# Altium project ZZCBoard2.0.PrjPCB
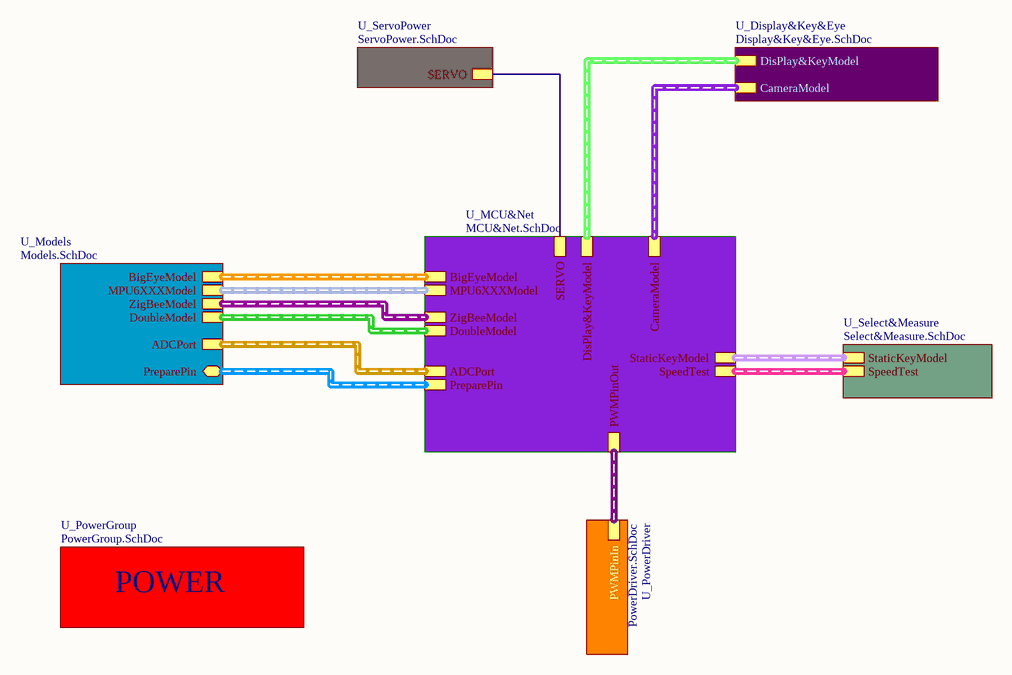
[diagram p0: BOSE.SchDoc]
8 sheets, 96 parts. Net scope: hierarchical (ports join the sheet entries above them; power ports are global).
Board file: BordPCB.PcbDoc
Sheets:
  BOSE.SchDoc
    U_MCU&Net = MCU&Net.SchDoc
    U_Display&Key&Eye = Display&Key&Eye.SchDoc
    U_PowerDriver = PowerDriver.SchDoc
    U_ServoPower = ServoPower.SchDoc
    U_Select&Measure = Select&Measure.SchDoc
    U_Models = Models.SchDoc
    U_PowerGroup = PowerGroup.SchDoc

## Sheet BOSE.SchDoc
size A4

### Sub-sheets
U_Display&Key&Eye = Display&Key&Eye.SchDoc: DisPlay&KeyModel (harness Display&Key), CameraModel (harness Camera)
U_MCU&Net = MCU&Net.SchDoc: ZigBeeModel (harness ZigBeeModel), CameraModel (harness Camera), BigEyeModel (harness BigEye), DisPlay&KeyModel (harness Display&Key), PWMPinOut (harness PWMPin), MPU6XXXModel (harness MPU6XXX), DoubleModel (harness Double), SpeedTest (harness Speed), SERVO, StaticKeyModel (harness StaticKey), PreparePin (harness Prepare), ADCPort (harness ADCPort)
U_Models = Models.SchDoc: MPU6XXXModel (harness MPU6XXX), ZigBeeModel (harness ZigBeeModel), BigEyeModel (harness BigEye), DoubleModel (harness Double), ADCPort (harness ADCPort), PreparePin (harness Prepare)
U_PowerDriver = PowerDriver.SchDoc: PWMPinIn (harness PWMPin)
U_PowerGroup = PowerGroup.SchDoc: no entries
U_Select&Measure = Select&Measure.SchDoc: SpeedTest (harness Speed), StaticKeyModel (harness StaticKey)
U_ServoPower = ServoPower.SchDoc: SERVO

### Nets
SERVO: sheet U_MCU&Net/SERVO, sheet U_ServoPower/SERVO

### Buses and harness runs
harness sheet U_Display&Key&Eye/CameraModel = sheet U_MCU&Net/CameraModel
harness sheet U_Display&Key&Eye/DisPlay&KeyModel = sheet U_MCU&Net/DisPlay&KeyModel
harness sheet U_MCU&Net/ADCPort = sheet U_Models/ADCPort
harness sheet U_MCU&Net/BigEyeModel = sheet U_Models/BigEyeModel
harness sheet U_MCU&Net/DoubleModel = sheet U_Models/DoubleModel
harness sheet U_MCU&Net/MPU6XXXModel = sheet U_Models/MPU6XXXModel
harness sheet U_MCU&Net/PreparePin = sheet U_Models/PreparePin
harness sheet U_MCU&Net/PWMPinOut = sheet U_PowerDriver/PWMPinIn
harness sheet U_MCU&Net/SpeedTest = sheet U_Select&Measure/SpeedTest
harness sheet U_MCU&Net/StaticKeyModel = sheet U_Select&Measure/StaticKeyModel
harness sheet U_MCU&Net/ZigBeeModel = sheet U_Models/ZigBeeModel

### Notes on the sheet
- POWER

## Sheet MCU&Net.SchDoc
size A4
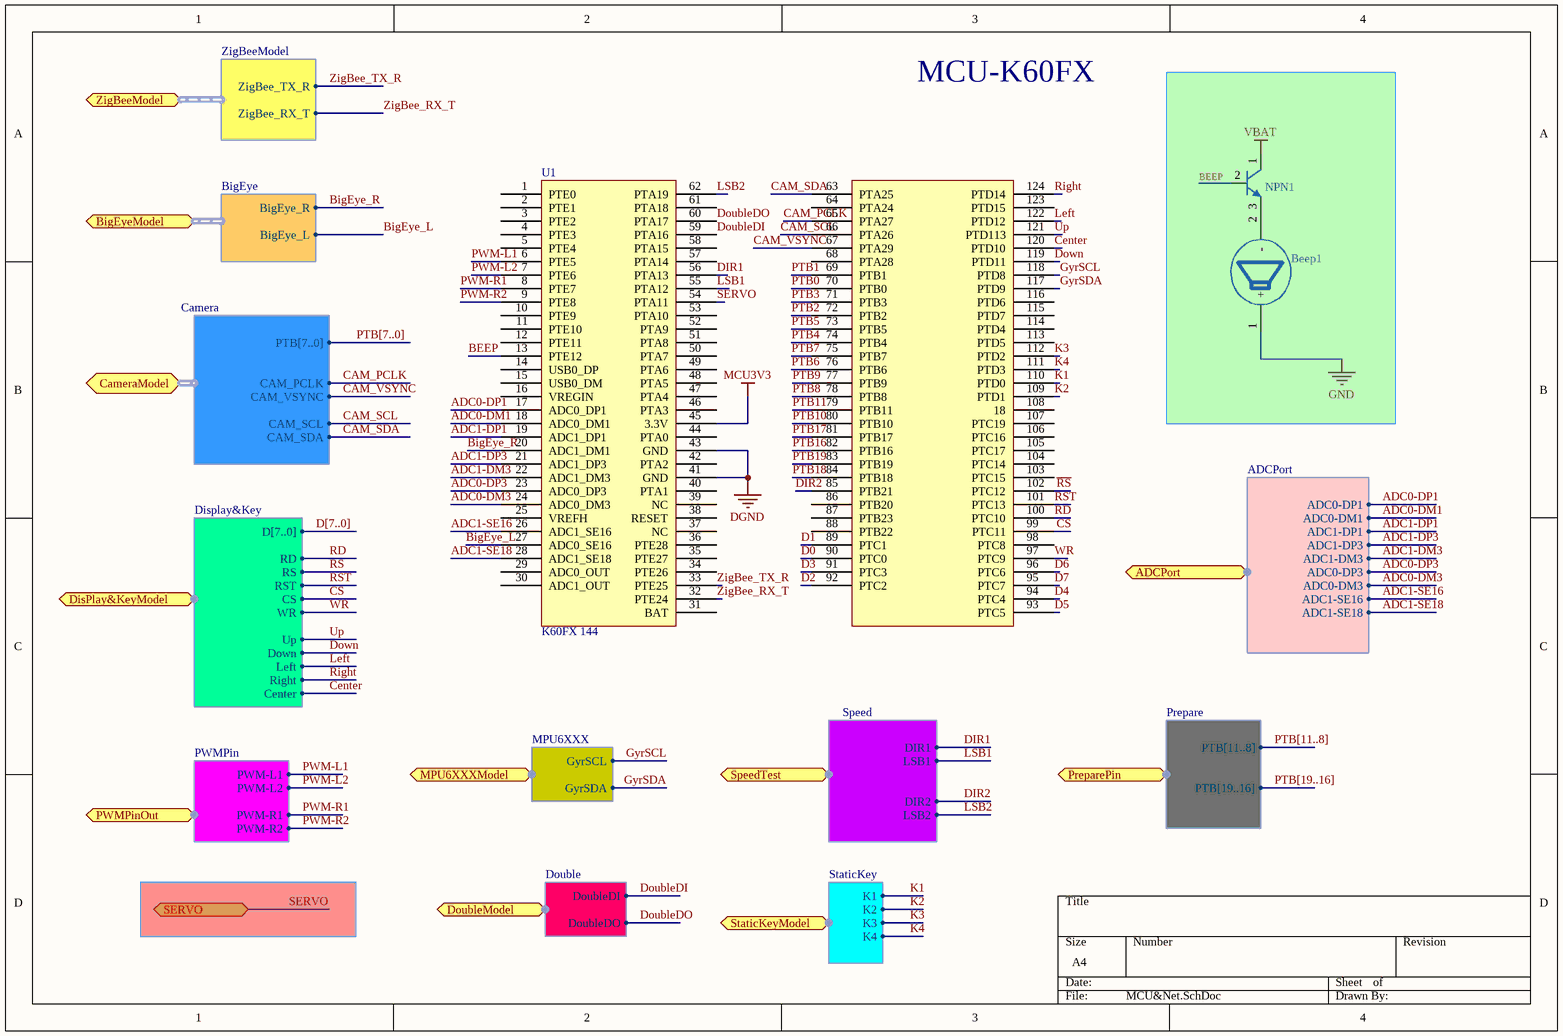
[diagram p1: MCU&Net.SchDoc]

### Parts
Beep1  BEEP  [BEEP]  (value not drawn)
NPN1  NPN  [三极管  NPN]  (value not drawn)
U1  K60FX 144  [K60FX 144]

### Ports
ADCPort (harness ADCPort), BigEyeModel (harness BigEye), CameraModel (harness Camera), DisPlay&KeyModel (harness Display&Key), DoubleModel (harness Double), MPU6XXXModel (harness MPU6XXX), PreparePin (harness Prepare), PWMPinOut (harness PWMPin), SERVO, SpeedTest (harness Speed), StaticKeyModel (harness StaticKey), ZigBeeModel (harness ZigBeeModel)

### Harnesses
Camera: PTB[7..0], CAM_PCLK, CAM_SCL, CAM_VSYNC, CAM_SDA
ZigBeeModel: ZigBee_TX_R, ZigBee_RX_T
BigEye: BigEye_R, BigEye_L
Display&Key: D[7..0], RD, RS, RST, CS, Up, Down, Left, Right, Center, WR
PWMPin: PWM-L1, PWM-L2, PWM-R1, PWM-R2
MPU6XXX: GyrSCL, GyrSDA
Double: DoubleDI, DoubleDO
Speed: DIR1, LSB1, LSB2, DIR2
StaticKey: K1, K2, K3, K4
Prepare: PTB[11..8], PTB[19..16]
ADCPort: ADC0-DP1, ADC0-DM1, ADC1-DP1, ADC1-DP3, ADC1-DM3, ADC0-DP3, ADC0-DM3, ADC1-SE16, ADC1-SE18

### Nets
DGND: U1.41(GND) U1.43(GND)
GND: Beep1.1(+)
MCU3V3: U1.45(3.3V)
VBAT: NPN1.1
ADC0-DM1: U1.18(ADC0_DM1) ; port ADCPort.ADC0-DM1
ADC0-DM3: U1.24(ADC0_DM3) ; port ADCPort.ADC0-DM3
ADC0-DP1: U1.17(ADC0_DP1) ; port ADCPort.ADC0-DP1
ADC0-DP3: U1.23(ADC0_DP3) ; port ADCPort.ADC0-DP3
ADC1-DM3: U1.22(ADC1_DM3) ; port ADCPort.ADC1-DM3
ADC1-DP1: U1.19(ADC1_DP1) ; port ADCPort.ADC1-DP1
ADC1-DP3: U1.21(ADC1_DP3) ; port ADCPort.ADC1-DP3
ADC1-SE16: U1.26(ADC1_SE16) ; port ADCPort.ADC1-SE16
ADC1-SE18: U1.28(ADC1_SE18) ; port ADCPort.ADC1-SE18
BEEP: NPN1.2 U1.13(PTE12)
BigEye_L: U1.27(ADC0_SE16) ; port BigEyeModel.BigEye_L
BigEye_R: U1.20(ADC1_DM1) ; port BigEyeModel.BigEye_R
CAM_PCLK: U1.65(PTA27) ; port CameraModel.CAM_PCLK
CAM_SCL: U1.66(PTA26) ; port CameraModel.CAM_SCL
CAM_SDA: U1.63(PTA25) ; port CameraModel.CAM_SDA
CAM_VSYNC: U1.67(PTA29) ; port CameraModel.CAM_VSYNC
Center: U1.120(PTD10) ; port DisPlay&KeyModel.Center
CS: U1.99(PTC11) ; port DisPlay&KeyModel.CS
D0: U1.90(PTC0)
D1: U1.89(PTC1)
D2: U1.92(PTC2)
D3: U1.91(PTC3)
D4: U1.94(PTC4)
D5: U1.93(PTC5)
D6: U1.96(PTC6)
D7: U1.95(PTC7)
DIR1: U1.56(PTA13) ; port SpeedTest.DIR1
DIR2: U1.85(PTB21) ; port SpeedTest.DIR2
DoubleDI: U1.59(PTA16) ; port DoubleModel.DoubleDI
DoubleDO: U1.60(PTA17) ; port DoubleModel.DoubleDO
Down: U1.119(PTD11) ; port DisPlay&KeyModel.Down
GyrSCL: U1.118(PTD8) ; port MPU6XXXModel.GyrSCL
GyrSDA: U1.117(PTD9) ; port MPU6XXXModel.GyrSDA
K1: U1.110(PTD0) ; port StaticKeyModel.K1
K2: U1.109(PTD1) ; port StaticKeyModel.K2
K3: U1.112(PTD2) ; port StaticKeyModel.K3
K4: U1.111(PTD3) ; port StaticKeyModel.K4
Left: U1.122(PTD12) ; port DisPlay&KeyModel.Left
LSB1: U1.55(PTA12) ; port SpeedTest.LSB1
LSB2: U1.62(PTA19) ; port SpeedTest.LSB2
PTB0: U1.70(PTB0)
PTB1: U1.69(PTB1)
PTB2: U1.72(PTB2)
PTB3: U1.71(PTB3)
PTB4: U1.74(PTB4)
PTB5: U1.73(PTB5)
PTB6: U1.76(PTB6)
PTB7: U1.75(PTB7)
PTB8: U1.78(PTB8)
PTB9: U1.77(PTB9)
PTB10: U1.80(PTB10)
PTB11: U1.79(PTB11)
PTB16: U1.82(PTB16)
PTB17: U1.81(PTB17)
PTB18: U1.84(PTB18)
PTB19: U1.83(PTB19)
PWM-L1: U1.6(PTE5) ; port PWMPinOut.PWM-L1
PWM-L2: U1.7(PTE6) ; port PWMPinOut.PWM-L2
PWM-R1: U1.8(PTE7) ; port PWMPinOut.PWM-R1
PWM-R2: U1.9(PTE8) ; port PWMPinOut.PWM-R2
~{RS}: U1.102(PTC12) ; port DisPlay&KeyModel.RS
RD: U1.100(PTC10) ; port DisPlay&KeyModel.RD
Right: U1.124(PTD14) ; port DisPlay&KeyModel.Right
RST: U1.101(PTC13) ; port DisPlay&KeyModel.RST
SERVO: U1.54(PTA11) ; port SERVO
Up: U1.121(PTD113) ; port DisPlay&KeyModel.Up
WR: U1.97(PTC9) ; port DisPlay&KeyModel.WR
ZigBee_RX_T: U1.32(PTE24) ; port ZigBeeModel.ZigBee_RX_T
ZigBee_TX_R: U1.33(PTE25) ; port ZigBeeModel.ZigBee_TX_R
NetBeep1_2: Beep1.2(-) NPN1.3

Not connected (* = marked no-connect by the designer): U1 1(PTE0) 2(PTE1) 3(PTE2) 4(PTE3) 5(PTE4) 10(PTE9) 11(PTE10) 12(PTE11) 14(USB0_DP) 15(USB0_DM) 16(VREGIN) 25(VREFH) 29(ADC0_OUT) 30(ADC1_OUT) 31(BAT) 34(PTE26) 35(PTE27) 36(PTE28) 37(NC) 38(RESET) 39(NC) 40(PTA1) 42(PTA2) 44(PTA0) 46(PTA3) 47(PTA4) 48(PTA5) 49(PTA6) 50(PTA7) 51(PTA8) 52(PTA9) 53(PTA10) 57(PTA14) 58(PTA15) 61(PTA18) 64(PTA24) 68(PTA28) 86(PTB20) 87(PTB23) 88(PTB22) 98(PTC8) 103(PTC15) 104(PTC14) 105(PTC17) 106(PTC16) 107(PTC19) 108(18) 113(PTD5) 114(PTD4) 115(PTD7) 116(PTD6) 123(PTD15)

### Buses and harness runs
bus D[7..0]
bus PTB[7..0]
bus PTB[11..8]
bus PTB[19..16]

### Notes on the sheet
- MCU-K60FX

### Library data of the parts
Beep1 = 蜂鸣器
U1 = K60FX   144

## Sheet Display&Key&Eye.SchDoc
size A4
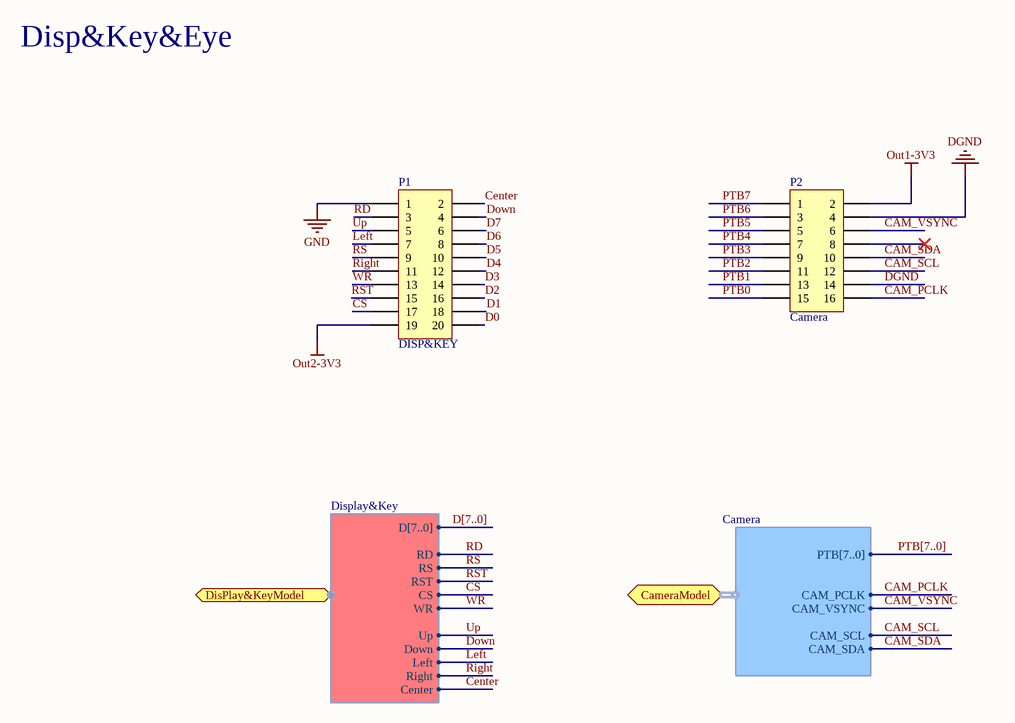
[diagram p2: Display&Key&Eye.SchDoc]

### Parts
P1  DISP&KEY  [HDR2X10]
P2  Camera  [HDR2X8]

### Ports
CameraModel (harness Camera), DisPlay&KeyModel (harness Display&Key)

### Harnesses
Display&Key: D[7..0], RD, RS, RST, CS, Up, Down, Left, Right, Center, WR
Camera: PTB[7..0], CAM_PCLK, CAM_SCL, CAM_VSYNC, CAM_SDA

### Nets
DGND: P2.4 P2.14
GND: P1.1
Out1-3V3: P2.2
Out2-3V3: P1.19
CAM_PCLK: P2.16 ; port CameraModel.CAM_PCLK
CAM_SCL: P2.12 ; port CameraModel.CAM_SCL
CAM_SDA: P2.10 ; port CameraModel.CAM_SDA
CAM_VSYNC: P2.6 ; port CameraModel.CAM_VSYNC
Center: P1.2 ; port DisPlay&KeyModel.Center
CS: P1.17 ; port DisPlay&KeyModel.CS
D0: P1.20
D1: P1.18
D2: P1.16
D3: P1.14
D4: P1.12
D5: P1.10
D6: P1.8
D7: P1.6
Down: P1.4 ; port DisPlay&KeyModel.Down
Left: P1.7 ; port DisPlay&KeyModel.Left
PTB0: P2.15
PTB1: P2.13
PTB2: P2.11
PTB3: P2.9
PTB4: P2.7
PTB5: P2.5
PTB6: P2.3
PTB7: P2.1
~{RS}: P1.9 ; port DisPlay&KeyModel.RS
RD: P1.3 ; port DisPlay&KeyModel.RD
Right: P1.11 ; port DisPlay&KeyModel.Right
RST: P1.15 ; port DisPlay&KeyModel.RST
Up: P1.5 ; port DisPlay&KeyModel.Up
WR: P1.13 ; port DisPlay&KeyModel.WR

Not connected (* = marked no-connect by the designer): P2 8*

### Buses and harness runs
bus D[7..0]
bus PTB[7..0]

### Notes on the sheet
- Disp&Key&Eye

### Library data of the parts
P1 = Header 10X2: Header, 10-Pin, Dual row; LatestRevisionDate: 17-Jul-2002; LatestRevisionNote: Re-released for DXP Platform.; Publisher: Altium Limited
P2 = Header 8X2: Header, 8-Pin, Dual row; LatestRevisionDate: 17-Jul-2002; LatestRevisionNote: Re-released for DXP Platform.; Publisher: Altium Limited

## Sheet PowerDriver.SchDoc
size A4
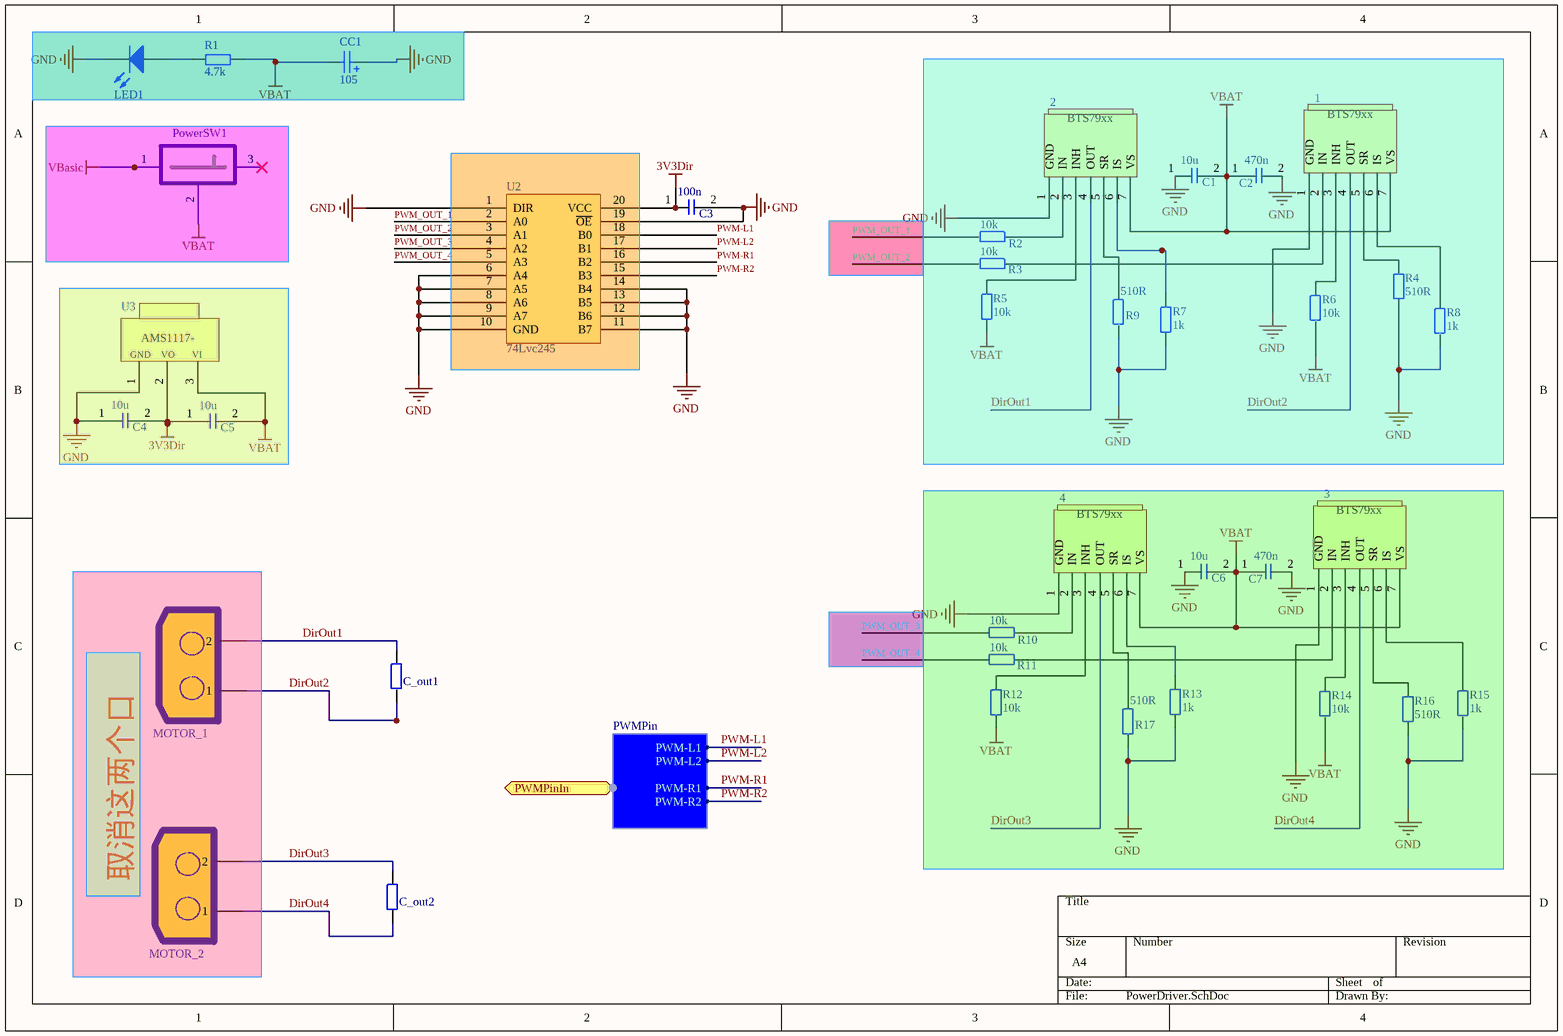
[diagram p3: PowerDriver.SchDoc]

### Parts
1  BTS79xx  [BTS79xx]  (value not drawn)
2  BTS79xx  [BTS79xx]  (value not drawn)
3  BTS79xx  [BTS79xx]  (value not drawn)
4  BTS79xx  [BTS79xx]  (value not drawn)
C1  10u  [0805电容]
C2  470n  [0805电容]
C3  100n  [0805电容]
C4  10u  [0805电容]
C5  10u  [0805电容]
C6  10u  [0805电容]
C7  470n  [0805电容]
C_out1  0  [0805电阻]  (value not drawn)
C_out2  0  [0805电阻]  (value not drawn)
CC1  Capacitance: 105  [CAPMP6032X26N]  (hidden comment: Cap Tan C)
LED1  0805LED  [0805LED]  (value not drawn)
MOTOR_1  P  [2脚接头]  (value not drawn)
MOTOR_2  P  [2脚接头]  (value not drawn)
PowerSW1  Power  [PowerSW]  (value not drawn)
R1  4.7k  [0805电阻]
R2  10k  [0805电阻]
R3  10k  [0805电阻]
R4  510R  [0805电阻]
R5  10k  [0805电阻]
R6  10k  [0805电阻]
R7  1k  [0805电阻]
R8  1k  [0805电阻]
R9  510R  [0805电阻]
R10  10k  [0805电阻]
R11  10k  [0805电阻]
R12  10k  [0805电阻]
R13  1k  [0805电阻]
R14  10k  [0805电阻]
R15  1k  [0805电阻]
R16  510R  [0805电阻]
R17  510R  [0805电阻]
U2  74Lvc245  [TSOP65P650X110-20N]
U3  AMS1117-  [AMS1117-]  (value not drawn)

### Blocks framed on the sheet
取消这两个口: MOTOR_1 MOTOR_2

### Ports
PWMPinIn (harness PWMPin)

### Harnesses
PWMPin: PWM-L1, PWM-L2, PWM-R1, PWM-R2

### Nets
3V3Dir: C3.1 C4.2 C5.1 U2.20(VCC) U3.2(Vout)
GND: 1.1(GND) 2.1(GND) 3.1(GND) 4.1(GND) C1.1 C2.2 C3.2 C4.1 C6.1 C7.2 CC1.2 LED1.2(K) R4.1 R7.1 R8.1 R9.1 R13.1 R15.1 R16.1 R17.1 U2.1(DIR) U2.6(A4) U2.7(A5) U2.8(A6) U2.9(A7) U2.10(GND) U2.11(B7) U2.12(B6) U2.13(B5) U2.14(B4) U2.19(~{OE}) U3.1(GND)
VBasic: PowerSW1.1
VBAT: 1.7(VS) 2.7(VS) 3.7(VS) 4.7(VS) C1.2 C2.1 C5.2 C6.2 C7.1 CC1.1 PowerSW1.2 R1.1 R5.1 R6.1 R12.1 R14.1 U3.3(Vin)
DirOut1: 2.4(OUT) C_out1.2 MOTOR_1.2
DirOut2: 1.4(OUT) C_out1.1 MOTOR_1.1
DirOut3: 4.4(OUT) C_out2.2 MOTOR_2.2
DirOut4: 3.4(OUT) C_out2.1 MOTOR_2.1
PWM-L1: U2.18(B0) ; port PWMPinIn.PWM-L1
PWM-L2: U2.17(B1) ; port PWMPinIn.PWM-L2
PWM-R1: U2.16(B2) ; port PWMPinIn.PWM-R1
PWM-R2: U2.15(B3) ; port PWMPinIn.PWM-R2
PWM_OUT_1: R2.1 U2.2(A0)
PWM_OUT_2: R3.1 U2.3(A1)
PWM_OUT_3: R10.1 U2.4(A2)
PWM_OUT_4: R11.1 U2.5(A3)
Net1_2: 1.2(IN) R3.2
Net1_3: 1.3(INH) R6.2
Net1_5: 1.5(SR) R4.2
Net1_6: 1.6(IS) R8.2
Net2_2: 2.2(IN) R2.2
Net2_3: 2.3(INH) R5.2
Net2_5: 2.5(SR) R9.2
Net2_6: 2.6(IS) R7.2
Net3_2: 3.2(IN) R11.2
Net3_3: 3.3(INH) R14.2
Net3_5: 3.5(SR) R16.2
Net3_6: 3.6(IS) R15.2
Net4_2: 4.2(IN) R10.2
Net4_3: 4.3(INH) R12.2
Net4_5: 4.5(SR) R17.2
Net4_6: 4.6(IS) R13.2
NetLED1_1: LED1.1(A) R1.2

Not connected (* = marked no-connect by the designer): PowerSW1 3*

### Notes on the sheet
- (in symbol AMS1117-) VO; VI

### Library data of the parts
C1-C7 = 0805电容
C_out1 C_out2 R1-R17 = 0805电阻
CC1 = Cap Tan C: Polarized Capacitor (Radial); Voltage: 16V; Published: 8-Jun-2000; Revision: July-2002: Re-released for DXP Platform.; Publisher: Altium Limited
MOTOR_1 MOTOR_2 = 2脚接头
PowerSW1 = PowerSW

## Sheet ServoPower.SchDoc
size A4
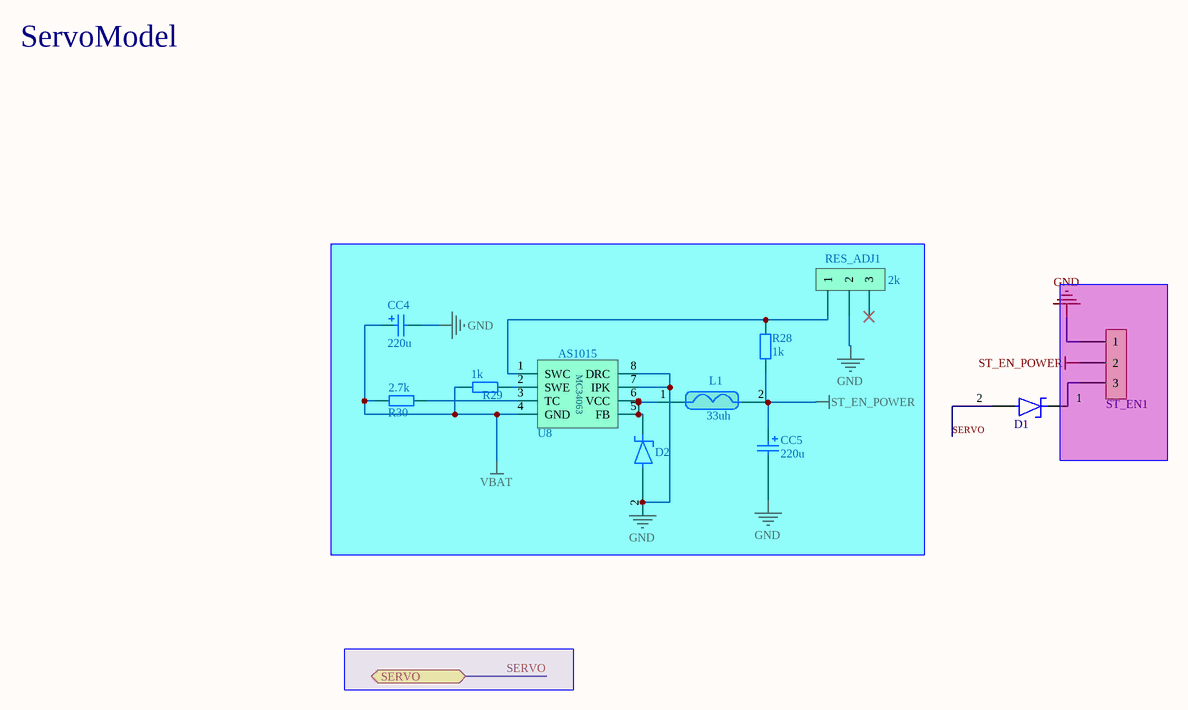
[diagram p4: ServoPower.SchDoc]

### Parts
CC4  Capacitance: 220u  [CAPMP6032X26N]  (hidden comment: Cap Tan C)
CC5  Capacitance: 220u  [CAPMP6032X26N]  (hidden comment: Cap Tan C)
D1  贴片二极管  [二极管SMA]  (value not drawn)
D2  贴片二极管  [二极管SMA]  (value not drawn)
L1  33uh  [电感7.3X7.3]
R28  1k  [0805电阻]
R29  1k  [0805电阻]
R30  2.7k  [0805电阻]
RES_ADJ1  2k  [Header3]
ST_EN1  Header3  [Header3]  (value not drawn)
U8  AS1015  [MC34063]

### Ports
SERVO

### Nets
GND: CC4.1 CC5.1 D2.2 RES_ADJ1.2 ST_EN1.1 U8.7(IPK) U8.8(DRC)
ST_EN_POWER: CC5.2 L1.2 R28.1 ST_EN1.2
VBAT: CC4.2 R29.1 R30.1 U8.4(GND)
SERVO: D1.2 ; port SERVO
NetD1_1: D1.1 ST_EN1.3
NetD2_1: D2.1 L1.1 U8.5(FB) U8.6(VCC)
NetR28_2: R28.2 RES_ADJ1.1 U8.1(SWC)
NetR29_2: R29.2 U8.2(SWE)
NetR30_2: R30.2 U8.3(TC)

Not connected (* = marked no-connect by the designer): RES_ADJ1 3*

### Notes on the sheet
- ServoModel

### Library data of the parts
CC4 CC5 = Cap Tan C: as CC1 on sheet PowerDriver; Published: 8-Jun-2000; Revision: July-2002: Re-released for DXP Platform.; Publisher: Altium Limited
L1 = 电感
R28-R30 = 0805电阻
RES_ADJ1 = Header3
U8 = MC34063

## Sheet Select&Measure.SchDoc
size A4
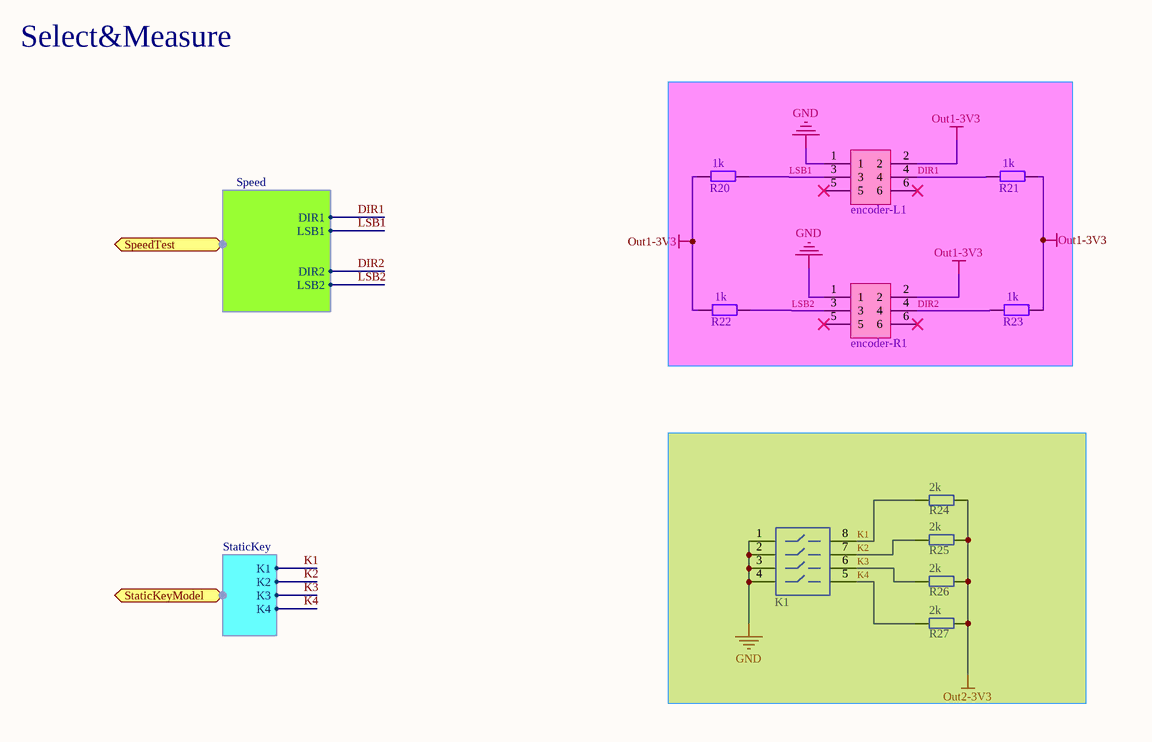
[diagram p5: Select&Measure.SchDoc]

### Parts
encoder-L1  编码器  [编码器]  (value not drawn)
encoder-R1  编码器  [编码器]  (value not drawn)
K1  拨码开关  [拨码开关]  (value not drawn)
R20  1k  [0805电阻]
R21  1k  [0805电阻]
R22  1k  [0805电阻]
R23  1k  [0805电阻]
R24  2k  [0805电阻]
R25  2k  [0805电阻]
R26  2k  [0805电阻]
R27  2k  [0805电阻]

### Ports
SpeedTest (harness Speed), StaticKeyModel (harness StaticKey)

### Harnesses
Speed: DIR1, LSB1, LSB2, DIR2
StaticKey: K1, K2, K3, K4

### Nets
GND: encoder-L1.1 encoder-R1.1 K1.1 K1.2 K1.3 K1.4
Out1-3V3: encoder-L1.2 encoder-R1.2 R20.1 R21.2 R22.1 R23.2
Out2-3V3: R24.2 R25.2 R26.2 R27.2
DIR1: encoder-L1.4 R21.1 ; port SpeedTest.DIR1
DIR2: encoder-R1.4 R23.1 ; port SpeedTest.DIR2
K1: K1.8 R24.1 ; port StaticKeyModel.K1
K2: K1.7 R25.1 ; port StaticKeyModel.K2
K3: K1.6 R26.1 ; port StaticKeyModel.K3
K4: K1.5 R27.1 ; port StaticKeyModel.K4
LSB1: encoder-L1.3 R20.2 ; port SpeedTest.LSB1
LSB2: encoder-R1.3 R22.2 ; port SpeedTest.LSB2

Not connected (* = marked no-connect by the designer): encoder-L1 5* 6*; encoder-R1 5* 6*

### Notes on the sheet
- Select&Measure

### Library data of the parts
R20-R27 = 0805电阻

## Sheet Models.SchDoc
size A4
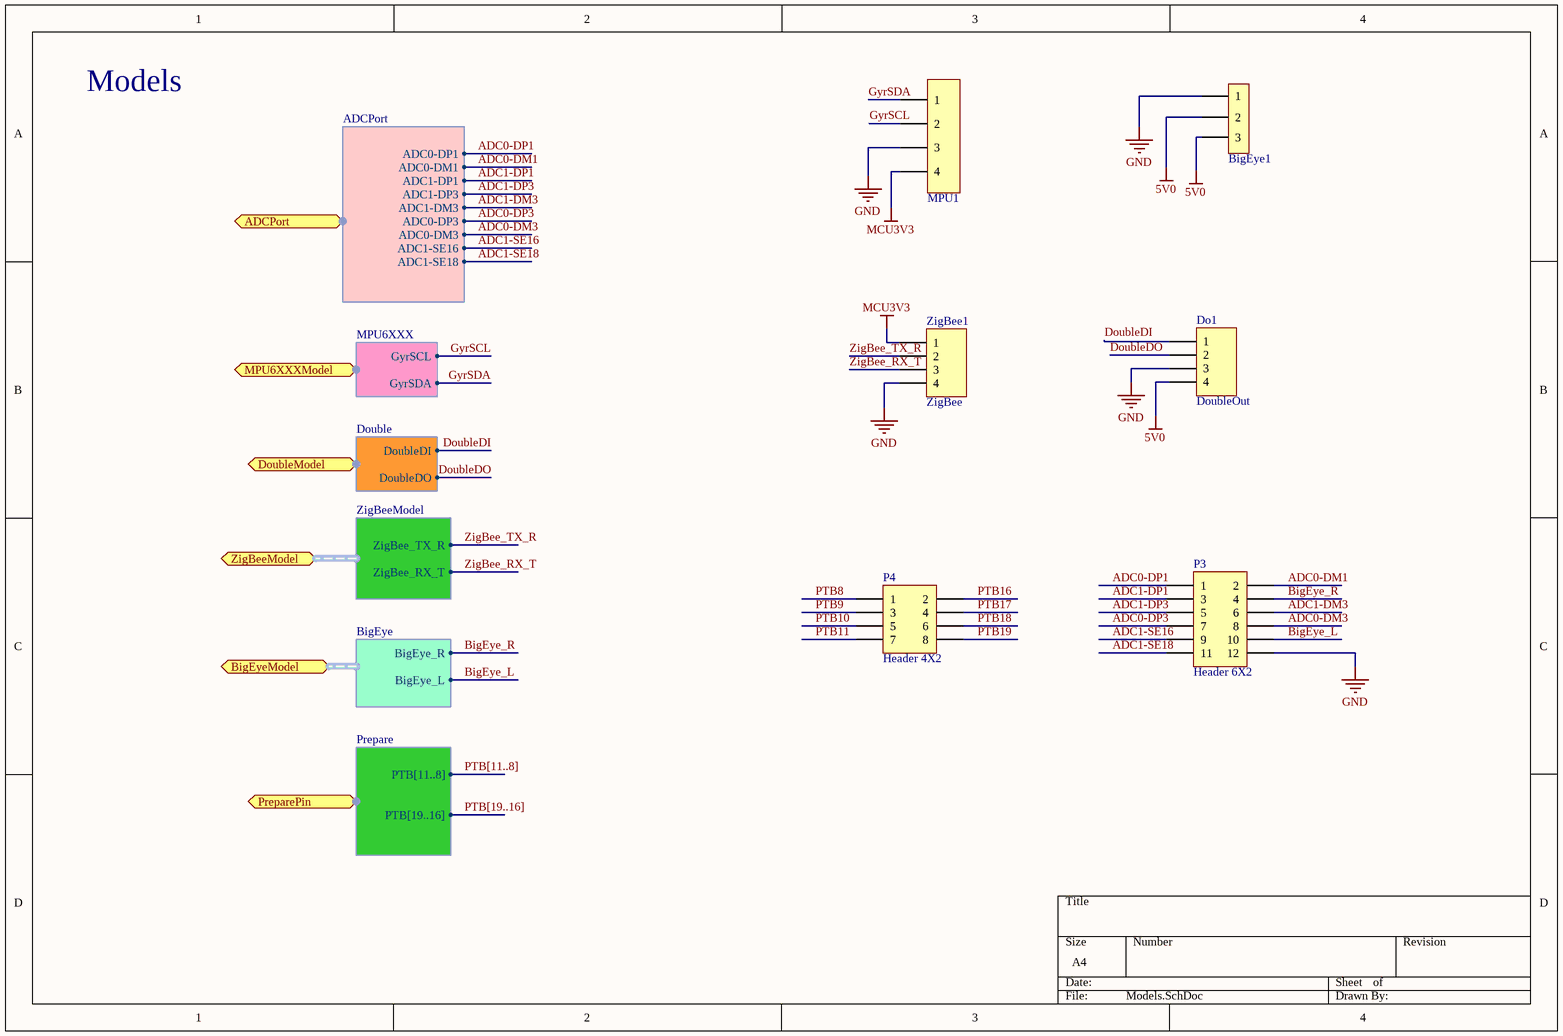
[diagram p6: Models.SchDoc]

### Parts
BigEye1  Header3  [Header3]  (value not drawn)
Do1  DoubleOut  [HDR1X4]
MPU1  Header4  [Header4]  (value not drawn)
P3  Header 6X2  [HDR2X6]
P4  Header 4X2  [HDR2X4]
ZigBee1  ZigBee  [HDR1X4]

### Ports
ADCPort (harness ADCPort), BigEyeModel (harness BigEye), DoubleModel (harness Double), MPU6XXXModel (harness MPU6XXX), PreparePin (harness Prepare), ZigBeeModel (harness ZigBeeModel)

### Harnesses
MPU6XXX: GyrSCL, GyrSDA
ZigBeeModel: ZigBee_TX_R, ZigBee_RX_T
BigEye: BigEye_R, BigEye_L
Double: DoubleDI, DoubleDO
ADCPort: ADC0-DP1, ADC0-DM1, ADC1-DP1, ADC1-DP3, ADC1-DM3, ADC0-DP3, ADC0-DM3, ADC1-SE16, ADC1-SE18
Prepare: PTB[11..8], PTB[19..16]

### Nets
5V0: BigEye1.2 BigEye1.3 Do1.4
GND: BigEye1.1 Do1.3 MPU1.3 P3.12 ZigBee1.4
MCU3V3: MPU1.4 ZigBee1.1
ADC0-DM1: P3.2 ; port ADCPort.ADC0-DM1
ADC0-DM3: P3.8 ; port ADCPort.ADC0-DM3
ADC0-DP1: P3.1 ; port ADCPort.ADC0-DP1
ADC0-DP3: P3.7 ; port ADCPort.ADC0-DP3
ADC1-DM3: P3.6 ; port ADCPort.ADC1-DM3
ADC1-DP1: P3.3 ; port ADCPort.ADC1-DP1
ADC1-DP3: P3.5 ; port ADCPort.ADC1-DP3
ADC1-SE16: P3.9 ; port ADCPort.ADC1-SE16
ADC1-SE18: P3.11 ; port ADCPort.ADC1-SE18
BigEye_L: P3.10 ; port BigEyeModel.BigEye_L
BigEye_R: P3.4 ; port BigEyeModel.BigEye_R
DoubleDI: Do1.1 ; port DoubleModel.DoubleDI
DoubleDO: Do1.2 ; port DoubleModel.DoubleDO
GyrSCL: MPU1.2 ; port MPU6XXXModel.GyrSCL
GyrSDA: MPU1.1 ; port MPU6XXXModel.GyrSDA
PTB8: P4.1
PTB9: P4.3
PTB10: P4.5
PTB11: P4.7
PTB16: P4.2
PTB17: P4.4
PTB18: P4.6
PTB19: P4.8
ZigBee_RX_T: ZigBee1.3 ; port ZigBeeModel.ZigBee_RX_T
ZigBee_TX_R: ZigBee1.2 ; port ZigBeeModel.ZigBee_TX_R

### Buses and harness runs
bus PTB[11..8]
bus PTB[19..16]

### Notes on the sheet
- Models

### Library data of the parts
Do1 ZigBee1 = Header 4: Header, 4-Pin; LatestRevisionDate: 17-Jul-2002; LatestRevisionNote: Re-released for DXP Platform.; Publisher: Altium Limited
P3 = Header 6X2: Header, 6-Pin, Dual row; LatestRevisionDate: 17-Jul-2002; LatestRevisionNote: Re-released for DXP Platform.; Publisher: Altium Limited
P4 = Header 4X2: Header, 4-Pin, Dual row; LatestRevisionDate: 17-Jul-2002; LatestRevisionNote: Re-released for DXP Platform.; Publisher: Altium Limited

## Sheet PowerGroup.SchDoc
size A4
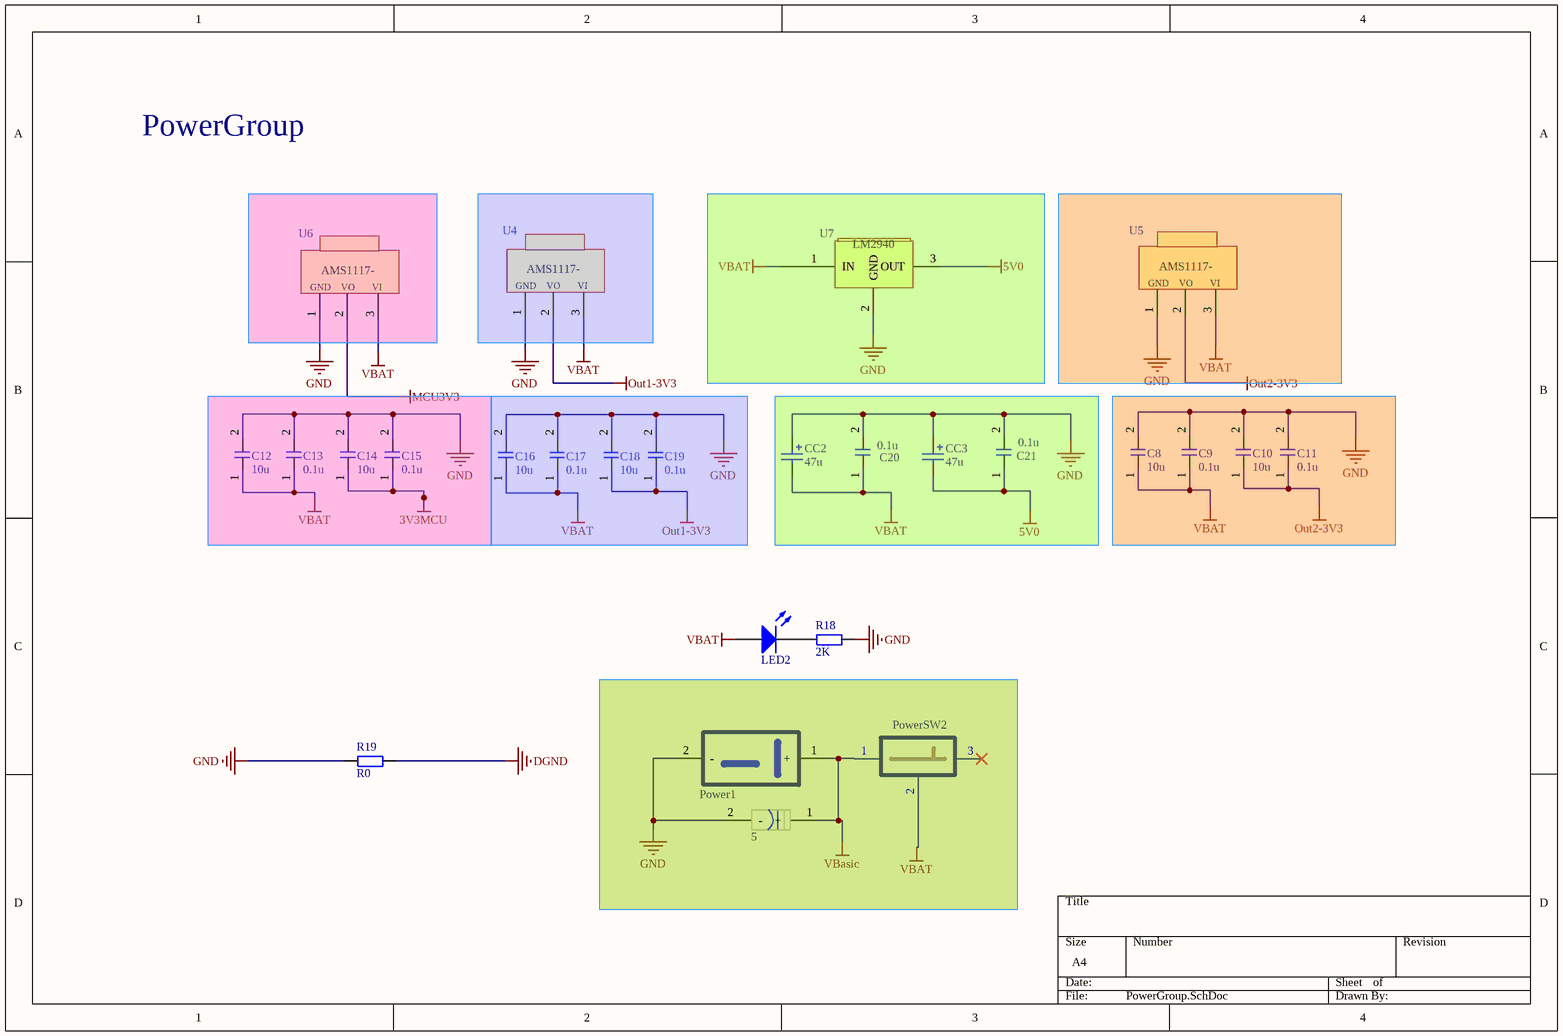
[diagram p7: PowerGroup.SchDoc]

### Parts
5  钽电容  [钽D]  (value not drawn)
C8  10u  [0805电容]
C9  0.1u  [0805电容]
C10  10u  [0805电容]
C11  0.1u  [0805电容]
C12  10u  [0805电容]
C13  0.1u  [0805电容]
C14  10u  [0805电容]
C15  0.1u  [0805电容]
C16  10u  [0805电容]
C17  0.1u  [0805电容]
C18  10u  [0805电容]
C19  0.1u  [0805电容]
C20  0.1u  [0805电容]
C21  0.1u  [0805电容]
CC2  Capacitance: 47u  [CAPMP6032X26N]  (hidden comment: Cap Tan C)
CC3  Capacitance: 47u  [CAPMP6032X26N]  (hidden comment: Cap Tan C)
LED2  0805LED  [0805LED]  (value not drawn)
Power1  XT60  [XT60]  (value not drawn)
PowerSW2  Power  [PowerSW]  (value not drawn)
R18  2K  [0805电阻]
R19  R0  [0805电阻]
U4  AMS1117-  [AMS1117-]  (value not drawn)
U5  AMS1117-  [AMS1117-]  (value not drawn)
U6  AMS1117-  [AMS1117-]  (value not drawn)
U7  LM2940  [LM2940]  (value not drawn)

### Nets
3V3MCU: C14.1 C15.1
5V0: C21.1 CC3.1 U7.3(OUT)
DGND: R19.1
GND: 5.2(-) C8.2 C9.2 C10.2 C11.2 C12.2 C13.2 C14.2 C15.2 C16.2 C17.2 C18.2 C19.2 C20.2 C21.2 CC2.2 CC3.2 Power1.2(-) R18.1 R19.2 U4.1(GND) U5.1(GND) U6.1(GND) U7.2(GND)
MCU3V3: U6.2(Vout)
Out1-3V3: C18.1 C19.1 U4.2(Vout)
Out2-3V3: C10.1 C11.1 U5.2(Vout)
VBasic: 5.1(+) Power1.1(+) PowerSW2.1
VBAT: C8.1 C9.1 C12.1 C13.1 C16.1 C17.1 C20.1 CC2.1 LED2.1(A) PowerSW2.2 U4.3(Vin) U5.3(Vin) U6.3(Vin) U7.1(IN)
NetLED2_2: LED2.2(K) R18.2

Not connected (* = marked no-connect by the designer): PowerSW2 3*

### Notes on the sheet
- PowerGroup
- (in symbol AMS1117-) VO; VI

### Library data of the parts
C8-C21 = 0805电容
CC2 CC3 = Cap Tan C: as CC1 on sheet PowerDriver; Published: 8-Jun-2000; Revision: July-2002: Re-released for DXP Platform.; Publisher: Altium Limited
PowerSW2 = PowerSW
R18 R19 = 0805电阻

## Nets that join several sheets
5V0: Models (BigEye1.2 BigEye1.3 Do1.4), PowerGroup (C21.1 CC3.1 U7.3)
DGND: MCU&Net (U1.41 U1.43), Display&Key&Eye (P2.4 P2.14), PowerGroup (R19.1)
GND: MCU&Net (Beep1.1), Display&Key&Eye (P1.1), PowerDriver (32 pins), ServoPower (7 pins), Select&Measure (6 pins), Models (5 pins), PowerGroup (24 pins)
MCU3V3: MCU&Net (U1.45), Models (MPU1.4 ZigBee1.1), PowerGroup (U6.2)
Out1-3V3: Display&Key&Eye (P2.2), Select&Measure (6 pins), PowerGroup (C18.1 C19.1 U4.2)
Out2-3V3: Display&Key&Eye (P1.19), Select&Measure (R24.2 R25.2 R26.2 R27.2), PowerGroup (C10.1 C11.1 U5.2)
VBasic: PowerDriver (PowerSW1.1), PowerGroup (5.1 Power1.1 PowerSW2.1)
VBAT: MCU&Net (NPN1.1), PowerDriver (17 pins), ServoPower (CC4.2 R29.1 R30.1 U8.4), PowerGroup (14 pins)
ADC0-DM1: MCU&Net (U1.18), Models (P3.2)
ADC0-DM3: MCU&Net (U1.24), Models (P3.8)
ADC0-DP1: MCU&Net (U1.17), Models (P3.1)
ADC0-DP3: MCU&Net (U1.23), Models (P3.7)
ADC1-DM3: MCU&Net (U1.22), Models (P3.6)
ADC1-DP1: MCU&Net (U1.19), Models (P3.3)
ADC1-DP3: MCU&Net (U1.21), Models (P3.5)
ADC1-SE16: MCU&Net (U1.26), Models (P3.9)
ADC1-SE18: MCU&Net (U1.28), Models (P3.11)
BigEye_L: MCU&Net (U1.27), Models (P3.10)
BigEye_R: MCU&Net (U1.20), Models (P3.4)
CAM_PCLK: MCU&Net (U1.65), Display&Key&Eye (P2.16)
CAM_SCL: MCU&Net (U1.66), Display&Key&Eye (P2.12)
CAM_SDA: MCU&Net (U1.63), Display&Key&Eye (P2.10)
CAM_VSYNC: MCU&Net (U1.67), Display&Key&Eye (P2.6)
Center: MCU&Net (U1.120), Display&Key&Eye (P1.2)
CS: MCU&Net (U1.99), Display&Key&Eye (P1.17)
D0: MCU&Net (U1.90), Display&Key&Eye (P1.20)
D1: MCU&Net (U1.89), Display&Key&Eye (P1.18)
D2: MCU&Net (U1.92), Display&Key&Eye (P1.16)
D3: MCU&Net (U1.91), Display&Key&Eye (P1.14)
D4: MCU&Net (U1.94), Display&Key&Eye (P1.12)
D5: MCU&Net (U1.93), Display&Key&Eye (P1.10)
D6: MCU&Net (U1.96), Display&Key&Eye (P1.8)
D7: MCU&Net (U1.95), Display&Key&Eye (P1.6)
DIR1: MCU&Net (U1.56), Select&Measure (encoder-L1.4 R21.1)
DIR2: MCU&Net (U1.85), Select&Measure (encoder-R1.4 R23.1)
DoubleDI: MCU&Net (U1.59), Models (Do1.1)
DoubleDO: MCU&Net (U1.60), Models (Do1.2)
Down: MCU&Net (U1.119), Display&Key&Eye (P1.4)
GyrSCL: MCU&Net (U1.118), Models (MPU1.2)
GyrSDA: MCU&Net (U1.117), Models (MPU1.1)
K1: MCU&Net (U1.110), Select&Measure (K1.8 R24.1)
K2: MCU&Net (U1.109), Select&Measure (K1.7 R25.1)
K3: MCU&Net (U1.112), Select&Measure (K1.6 R26.1)
K4: MCU&Net (U1.111), Select&Measure (K1.5 R27.1)
Left: MCU&Net (U1.122), Display&Key&Eye (P1.7)
LSB1: MCU&Net (U1.55), Select&Measure (encoder-L1.3 R20.2)
LSB2: MCU&Net (U1.62), Select&Measure (encoder-R1.3 R22.2)
PTB0: MCU&Net (U1.70), Display&Key&Eye (P2.15)
PTB1: MCU&Net (U1.69), Display&Key&Eye (P2.13)
PTB2: MCU&Net (U1.72), Display&Key&Eye (P2.11)
PTB3: MCU&Net (U1.71), Display&Key&Eye (P2.9)
PTB4: MCU&Net (U1.74), Display&Key&Eye (P2.7)
PTB5: MCU&Net (U1.73), Display&Key&Eye (P2.5)
PTB6: MCU&Net (U1.76), Display&Key&Eye (P2.3)
PTB7: MCU&Net (U1.75), Display&Key&Eye (P2.1)
PTB8: MCU&Net (U1.78), Models (P4.1)
PTB9: MCU&Net (U1.77), Models (P4.3)
PTB10: MCU&Net (U1.80), Models (P4.5)
PTB11: MCU&Net (U1.79), Models (P4.7)
PTB16: MCU&Net (U1.82), Models (P4.2)
PTB17: MCU&Net (U1.81), Models (P4.4)
PTB18: MCU&Net (U1.84), Models (P4.6)
PTB19: MCU&Net (U1.83), Models (P4.8)
PWM-L1: MCU&Net (U1.6), PowerDriver (U2.18)
PWM-L2: MCU&Net (U1.7), PowerDriver (U2.17)
PWM-R1: MCU&Net (U1.8), PowerDriver (U2.16)
PWM-R2: MCU&Net (U1.9), PowerDriver (U2.15)
~{RS}: MCU&Net (U1.102), Display&Key&Eye (P1.9)
RD: MCU&Net (U1.100), Display&Key&Eye (P1.3)
Right: MCU&Net (U1.124), Display&Key&Eye (P1.11)
RST: MCU&Net (U1.101), Display&Key&Eye (P1.15)
SERVO: MCU&Net (U1.54), ServoPower (D1.2)
Up: MCU&Net (U1.121), Display&Key&Eye (P1.5)
WR: MCU&Net (U1.97), Display&Key&Eye (P1.13)
ZigBee_RX_T: MCU&Net (U1.32), Models (ZigBee1.3)
ZigBee_TX_R: MCU&Net (U1.33), Models (ZigBee1.2)